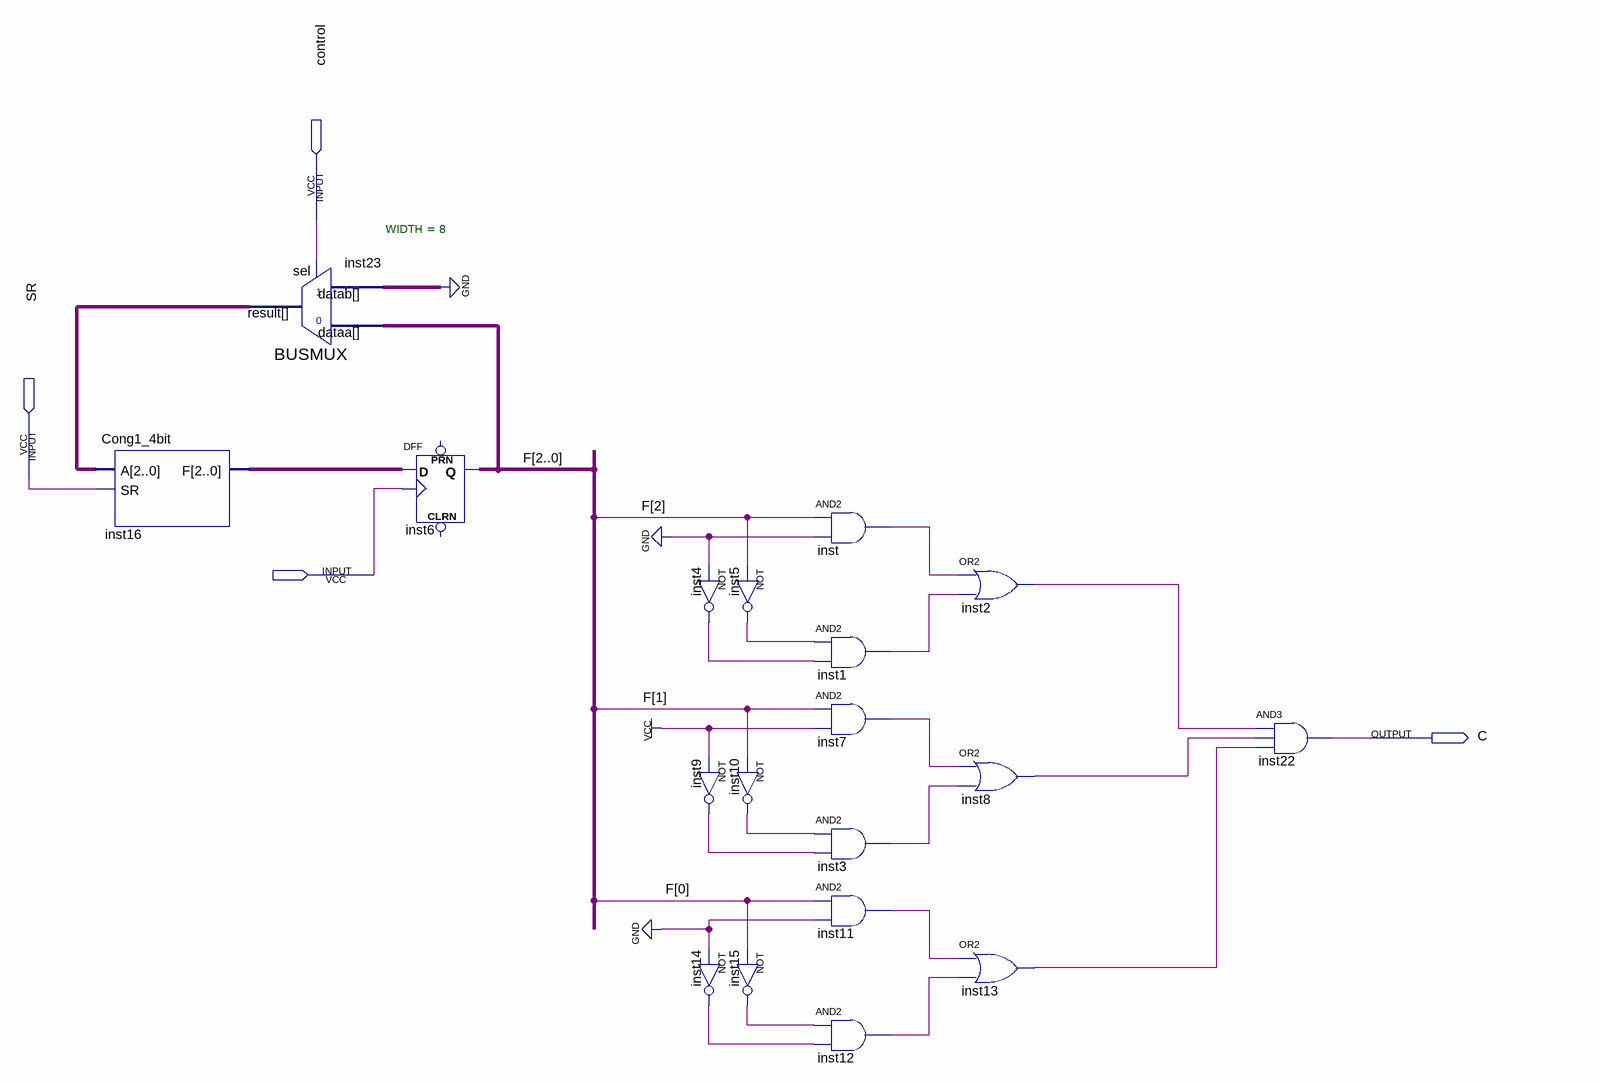
[diagram p0: schematic sheet]
// Quartus schematic CMPP.bdf as structural Verilog: 19 symbols, 4 pins
module CMPP (
  input  control,
  input  SR,
  output C
);

  wire inst1_out, inst2_out, inst3_out, inst4_out, inst5_out, inst7_out, inst8_out, inst9_out, inst10_out,
       inst11_out, inst12_out, inst13_out, inst14_out, inst15_out, inst_out, undriven;
  wire [2:0] F, inst16_f;
  wire [7:0] inst23_result;

  Cong1_4bit inst16 (.A(inst23_result), .SR(SR), .F(inst16_f));
  BUSMUX #(.WIDTH(8)) inst23 (.dataa(F), .datab({8{1'b0}}), .sel(control), .result(inst23_result));
  DFF inst6[2:0] (.CLK(undriven), .D(inst16_f), .Q(F));  // open: CLRN, PRN
  not inst4 (inst4_out, 1'b0);
  not inst5 (inst5_out, F[2]);
  not inst9 (inst9_out, 1'b1);
  not inst10 (inst10_out, F[1]);
  not inst14 (inst14_out, 1'b0);
  not inst15 (inst15_out, F[0]);
  and inst (inst_out, F[2], 1'b0);
  and inst1 (inst1_out, inst5_out, inst4_out);
  and inst7 (inst7_out, F[1], 1'b1);
  and inst3 (inst3_out, inst10_out, inst9_out);
  and inst11 (inst11_out, F[0], 1'b0);
  and inst12 (inst12_out, inst15_out, inst14_out);
  or inst2 (inst2_out, inst_out, inst1_out);
  or inst8 (inst8_out, inst7_out, inst3_out);
  or inst13 (inst13_out, inst11_out, inst12_out);
  and inst22 (C, inst2_out, inst8_out, inst13_out);
endmodule
